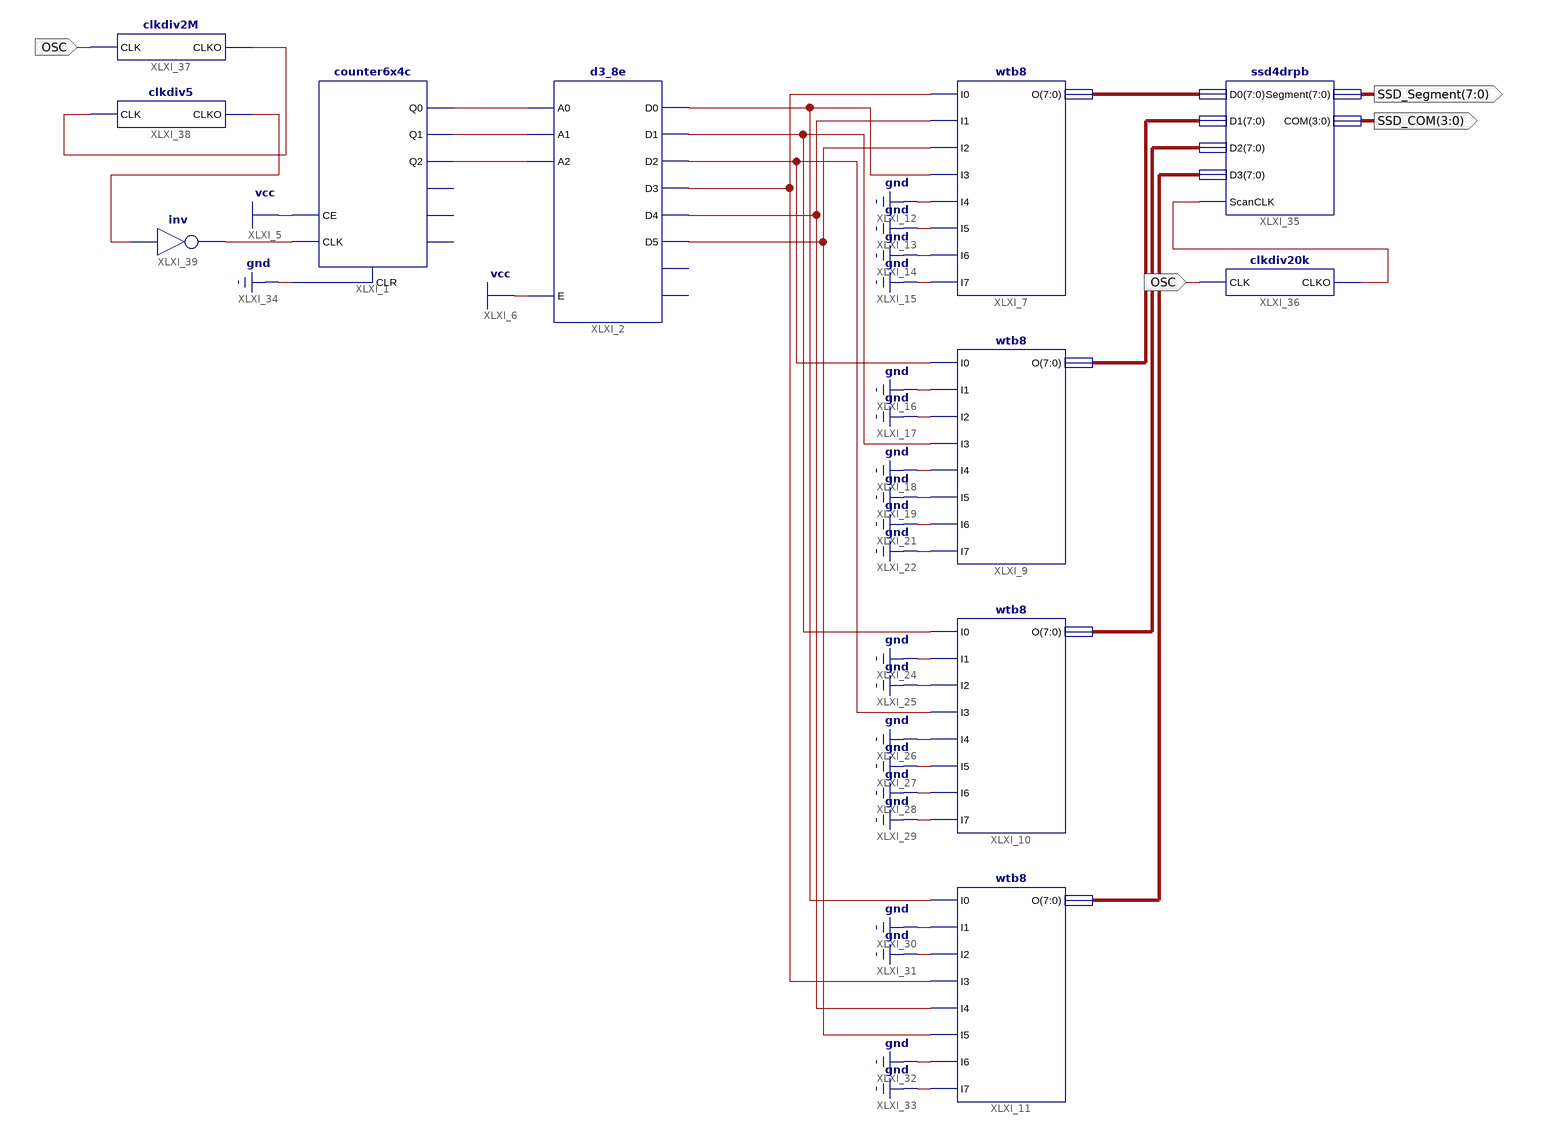
[diagram p0: schematic sheet 1]
// Xilinx ISE schematic main.sch (spartan6) as structural Verilog: 11 symbols, 3 ports
module main (
  input  OSC,
  output [3:0] SSD_COM,
  output [7:0] SSD_Segment
);

  wire XLXN_1, XLXN_2, XLXN_3, XLXN_6, XLXN_7, XLXN_8, XLXN_9, XLXN_11, XLXN_13, XLXN_41, XLXN_43, XLXN_48,
       XLXN_49;
  wire [7:0] XLXN_36, XLXN_37, XLXN_39, XLXN_40;

  counter6x4c XLXI_1 (
    .Q0(XLXN_1), .Q1(XLXN_2), .Q2(XLXN_3), .CE(1'b1), .CLK(XLXN_49), .CLR(1'b0));  // open: CEO, Q3, TC
  d3_8e XLXI_2 (
    .A0(XLXN_1), .A1(XLXN_2), .A2(XLXN_3), .E(1'b1), .D0(XLXN_6), .D1(XLXN_7), .D2(XLXN_8), .D3(XLXN_9),
    .D4(XLXN_11), .D5(XLXN_13));  // open: D6, D7
  wtb8 XLXI_7 (
    .I0(XLXN_9), .I1(XLXN_11), .I2(XLXN_13), .I3(XLXN_6), .I4(1'b0), .I5(1'b0), .I6(1'b0), .I7(1'b0),
    .O(XLXN_36));
  wtb8 XLXI_9 (.I0(XLXN_8), .I1(1'b0), .I2(1'b0), .I3(XLXN_7), .I4(1'b0), .I5(1'b0), .I6(1'b0), .I7(1'b0), .O(XLXN_37));
  wtb8 XLXI_10 (
    .I0(XLXN_7), .I1(1'b0), .I2(1'b0), .I3(XLXN_8), .I4(1'b0), .I5(1'b0), .I6(1'b0), .I7(1'b0), .O(XLXN_39));
  wtb8 XLXI_11 (
    .I0(XLXN_6), .I1(1'b0), .I2(1'b0), .I3(XLXN_9), .I4(XLXN_11), .I5(XLXN_13), .I6(1'b0), .I7(1'b0),
    .O(XLXN_40));
  ssd4drpb XLXI_35 (
    .COM(SSD_COM), .D0(XLXN_36), .D1(XLXN_37), .D2(XLXN_39), .D3(XLXN_40), .ScanCLK(XLXN_41),
    .Segment(SSD_Segment));
  clkdiv20k XLXI_36 (.CLK(OSC), .CLKO(XLXN_41));
  clkdiv2M XLXI_37 (.CLK(OSC), .CLKO(XLXN_43));
  clkdiv5 XLXI_38 (.CLK(XLXN_43), .CLKO(XLXN_48));
  not XLXI_39 (XLXN_49, XLXN_48);
endmodule
